# EAGLE board PROIECT (EAGLE 9.7.0)
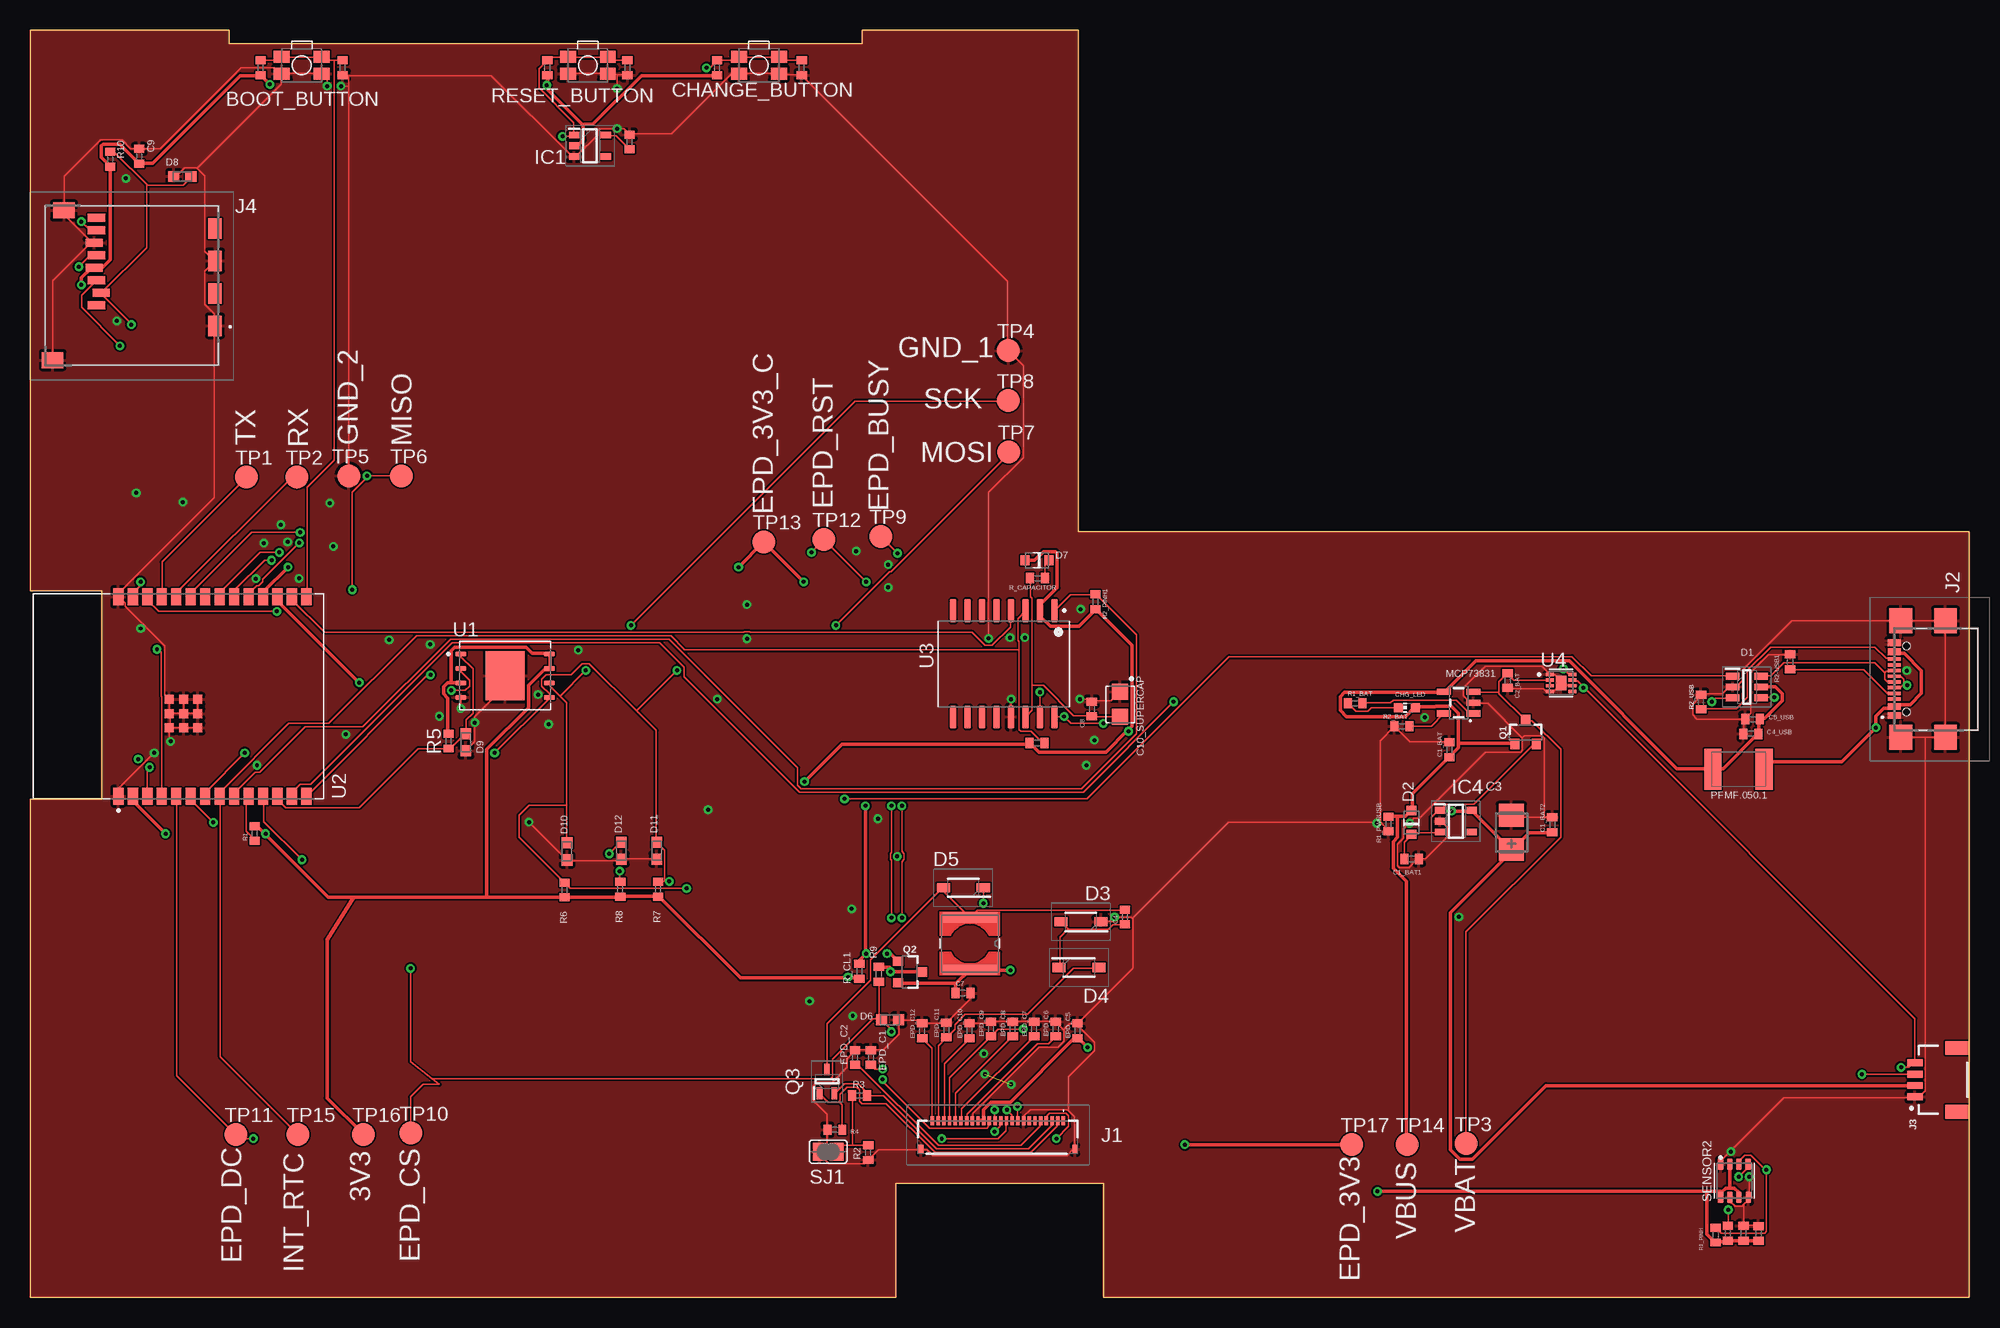
[diagram p1: board, top side]
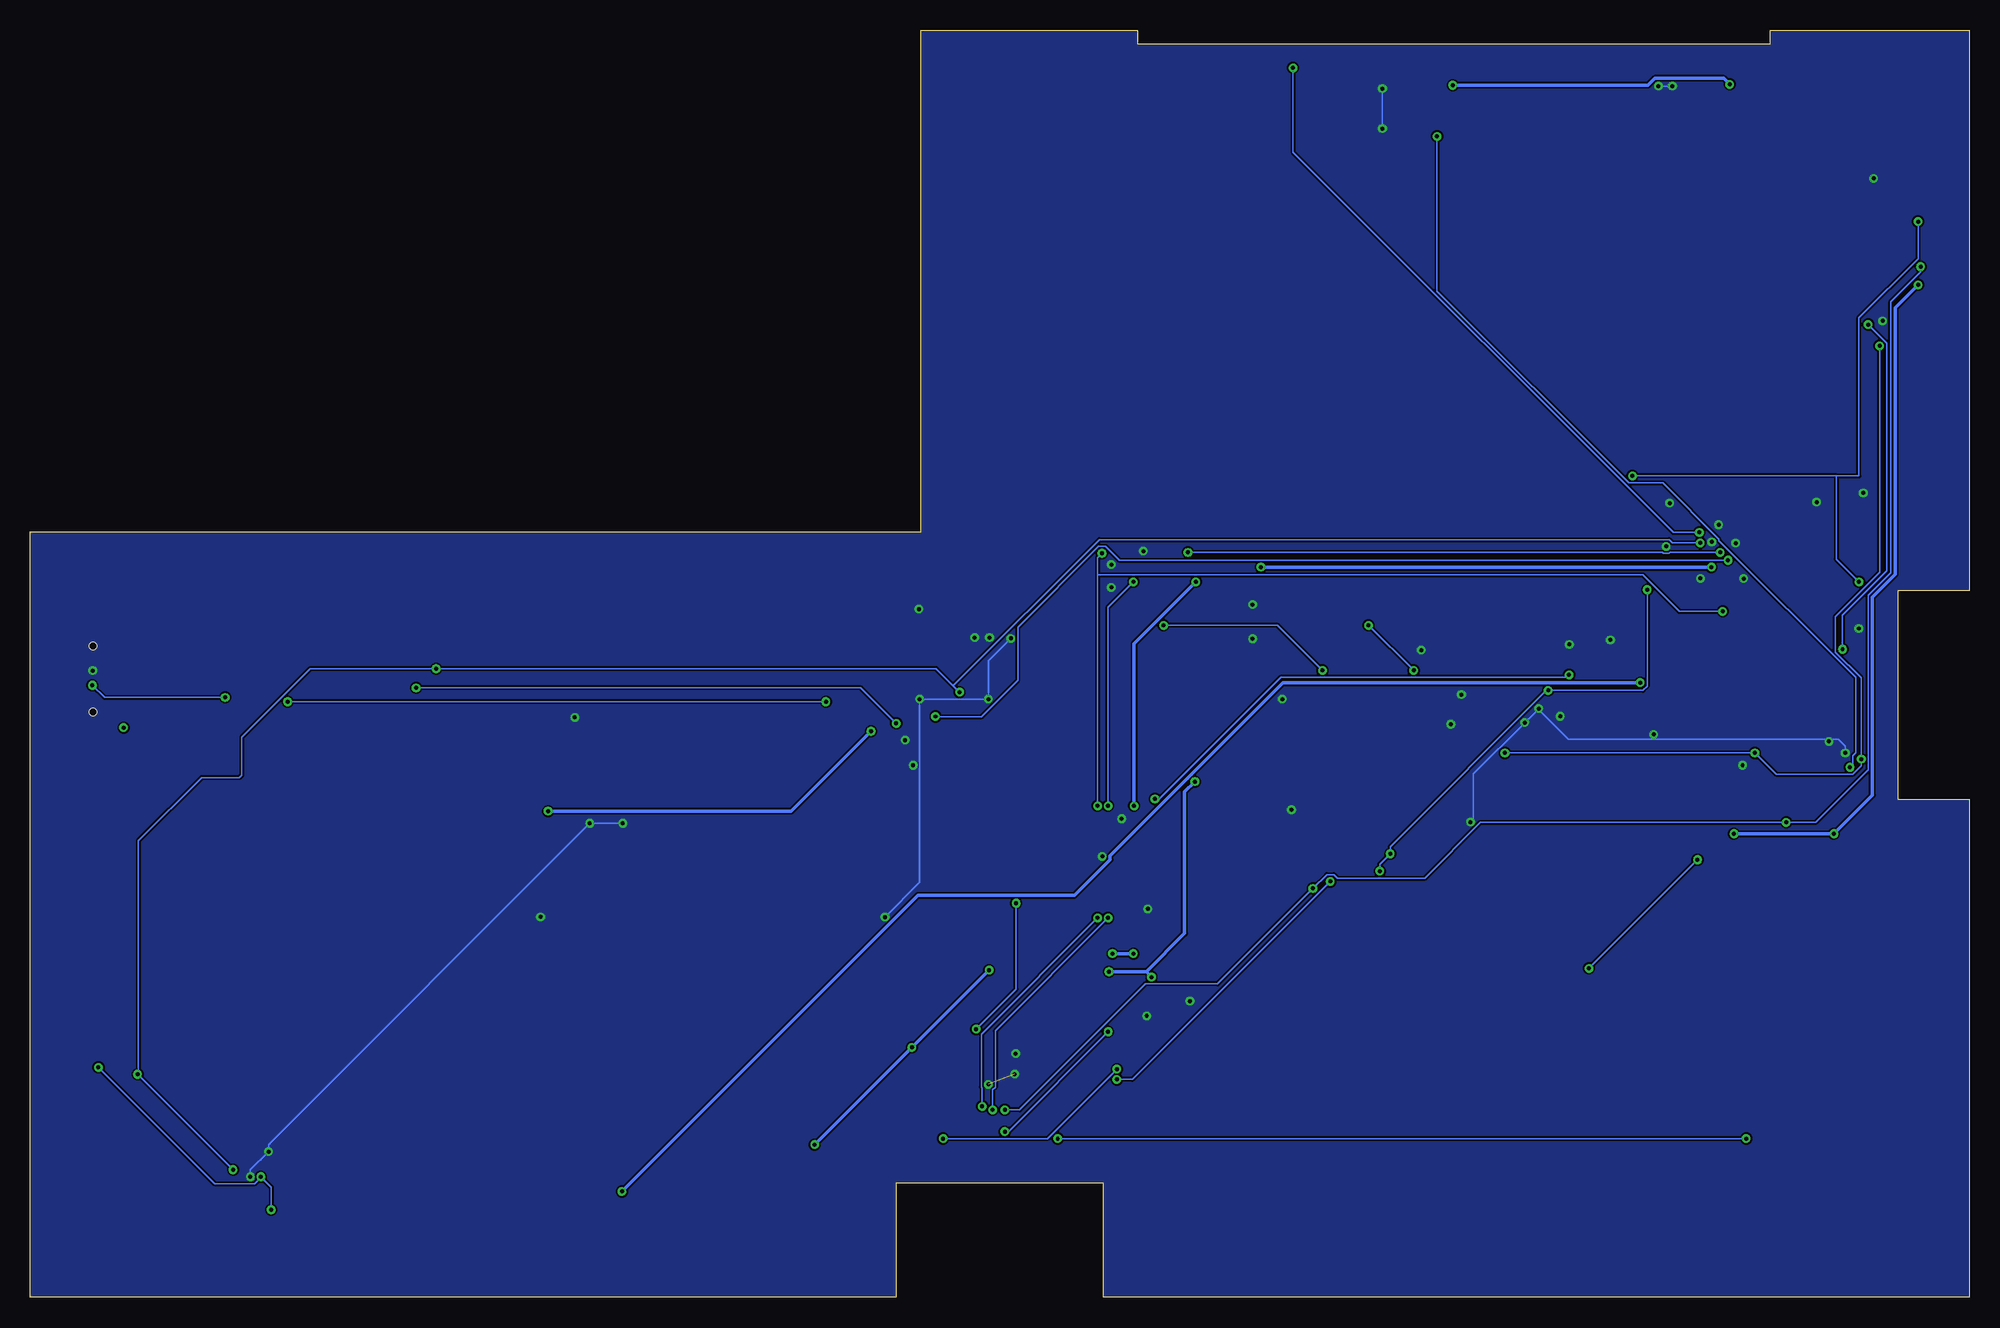
[diagram p2: board, bottom side, seen from below]

Size 170.2 x 111.2 mm. Coordinates in mm from the lower left corner, seen from the top.
Outline: 0,43.71 0,0 76,0 76,10 94.2,10 94.2,0 170.2,0 170.2,67.2 92,67.2 92,111.2 73,111.2 73,110 17.45,110 17.45,111.2 0,111.2 0,62 6.29,62 6.29,43.71 0,43.71
Copper layers (1*16): Top 0.035mm / dielectric 1.5mm / Bottom 0.035mm
Design rules "jlcpcb-2layers.dru": minimum track width 6mil, minimum drill 0.35mm, track to track 6mil, track to pad 6mil, pad to pad 6mil, via to via 6mil, smd to smd 6mil, copper to edge 0mil, drill to drill 6mil, minimum pad ring 10mil, minimum via ring 8mil, stop-mask expansion 4mil, vias tented up to drill 0mil, thermal gap 10mil
Net classes: 1 new_netclass: width 0.3 mm

## Footprints (pad centres in the part's own frame; a part is rotated, then mirrored left to right if it is on the bottom)
MYBUTTON = smd 1.4 x 1.05: 1 1.75,0.75; 2 -1.75,0.75; 3 -1.75,-0.75; 4 1.75,-0.75
ESP32_WROVER_EAGLE-LTSPICE_C0402 = smd 0.7 x 0.9: 1 -0.65,0; 2 0.65,0
EAGLE-LTSPICE_C0402 = smd 0.7 x 0.9: 1 -0.65,0; 2 0.65,0
RCL_CT3528 = smd 2 x 2.2: + -1.5,0; - 1.5,0
CAPCP3225X100N = smd 1.4 x 1.4: 1 -1.1,0; 2 1.1,0
ADAFRUIT_CHIP-LED0603 = smd 0.8 x 0.8: A 0,-0.75; C 0,0.75
SOT95P280X145-6N = smd 1.2 x 0.6: 1 -1.25,0.95; 2 -1.25,0; 3 -1.25,-0.95; 4 1.25,-0.95; 5 1.25,0; 6 1.25,0.95
ESP32_WROVER_AVX---SD0805S020S1R0_AVX_SD0805S020S1R0_0 = smd 0.8 x 0.9: 1 -1.05,0; 2 1.05,0
SOD3716X135N = smd 1.15 x 0.8: 1 -1.75,0; 2 1.75,0
DIOC1608X36N = smd 0.97 x 0.94: 1 -0.75,0; 2 0.75,0
SOT95P280X125-5N = smd 0.9 x 0.6: 1 -1.4,0.95; 2 -1.4,0; 3 -1.4,-0.95; 4 1.4,-0.95; 5 1.4,0.95
SOT95P280X120-5N = smd 0.9 x 0.6: 1 -1.4,0.95; 2 -1.4,0; 3 -1.4,-0.95; 4 1.4,-0.95; 5 1.4,0.95
FH34SRJ24S05SH99 = smd 0.3 x 0.8: 1 5.75,1.45; 2 5.25,1.45; 3 4.75,1.45; 4 4.25,1.45; 5 3.75,1.45; 6 3.25,1.45; 7 2.75,1.45; 8 2.25,1.45; 9 1.75,1.45; 10 1.25,1.45; 11 0.75,1.45; 12 0.25,1.45; 13 -0.25,1.45; 14 -0.75,1.45; 15 -1.25,1.45; 16 -1.75,1.45; 17 -2.25,1.45; 18 -2.75,1.45; 19 -3.25,1.45; 20 -3.75,1.45; 21 -4.25,1.45; 22 -4.75,1.45; 23 -5.25,1.45; 24 -5.75,1.45 | smd 0.4 x 0.8: MP1 6.75,-1.05; MP2 -6.75,-1.05
SAMACSYS_PARTS_USB4110GFA = smd 0.3 x 1.15: A1 -3.35,3.678; A4 -2.55,3.678; A5 -1.25,3.678; A6 -0.25,3.678; A7 0.25,3.678; A8 1.25,3.678; A9 2.55,3.678; A12 3.35,3.678; B1 3.05,3.678; B4 2.25,3.678; B5 1.75,3.678; B6 0.75,3.678; B7 -0.75,3.678; B8 -1.75,3.678; B9 -2.25,3.678; B12 -3.05,3.678 | smd 2.18 x 2: MP1 -5.11,-0.827; MP2 5.11,-0.827; MP3 -5.11,3.103; MP4 5.11,3.103 | hole 0.65: -2.89,2.603; 2.89,2.603
JST04_1MM_RA = smd 0.6 x 1.35: 1 -1.5,0; 2 -0.5,0; 3 0.5,0; 4 1.5,0 | smd 1.2 x 2: NC1 2.8,-3.675; NC2 -2.8,-3.675
112ATAARR03ATTEND = smd 1.8 x 1.2: G1 10.6,10.4; G2 4.9,10.4; S1 7.75,10.4; S2 2.05,10.4 | smd 1.4 x 1.9: G3 13.6,-3.85; G4 0.45,-2.85 | smd 0.7 x 1.5: P1 8.8,0; P2 7.7,0.4; P3 6.6,0; P4 5.5,-0.2; P5 4.4,0; P6 3.3,-0.2; P7 2.2,0; P8 1.1,0
IND_4828-WE-TPC_WRE = smd 0.889 x 4.826: 1 -2.286,0; 2 2.286,0
ESP32_WROVER_SPARKFUN-IC-POWER_SOT23-5 = smd 0.55 x 1.2: 1 -0.95,-1.3; 2 0,-1.3; 3 0.95,-1.3; 4 0.95,1.3; 5 -0.95,1.3
ESP32C6_VARISTOR_CT/CN1812 = smd 1.5 x 3.6: 1 -2.25,0; 2 2.25,0
ESP32_WROVER_SPARKFUN-DISCRETESEMI_SOT23-3 = smd 0.8 x 0.9: 1 -0.95,-1; 2 0.95,-1; 3 0,1.1
SOT65P210X110-3N = smd 1.05 x 0.5: 1 -1.05,0.65; 2 -1.05,-0.65; 3 1.05,0
ESP32_WROVER_EAGLE-LTSPICE_R0402 = smd 0.7 x 0.9: 1 -0.65,0; 2 0.65,0
ESP32_WROVER_BME680_PSON80P300X300X100-8N = smd 1.016 x 0.5: 1 1.458,1.2; 2 1.458,0.4; 3 1.458,-0.4; 4 1.458,-1.2; 5 -1.458,-1.22; 6 -1.458,-0.4; 7 -1.458,0.4; 8 -1.458,1.2
SJ = smd 1.168 x 1.6: 1 -0.762,0; 2 0.762,0
TP20R = smd 2 x 2: TP 0,0
SON127P600X800X80-9N = smd 0.94 x 0.44: 1 -3.895,1.905; 2 -3.895,0.635; 3 -3.895,-0.635; 4 -3.895,-1.905; 5 3.895,-1.905; 6 3.895,-0.635; 7 3.895,0.635; 8 3.895,1.905 | smd 3.4 x 4.3: 9 0,0
XCVR_ESP32-C6-WROOM-1-N8 = smd 1.5 x 0.9: 1 -8.75,5.26; 2 -8.75,3.99; 3 -8.75,2.72; 4 -8.75,1.45; 5 -8.75,0.18; 6 -8.75,-1.09; 7 -8.75,-2.36; 8 -8.75,-3.63; 9 -8.75,-4.9; 10 -8.75,-6.17; 11 -8.75,-7.44; 12 -8.75,-8.71; 13 -8.75,-9.98; 14 -8.75,-11.25; 15 8.75,-11.25; 16 8.75,-9.98; 17 8.75,-8.71; 18 8.75,-7.44; 19 8.75,-6.17; 20 8.75,-4.9; 21 8.75,-3.63; 22 8.75,-2.36; 23 8.75,-1.09; 24 8.75,0.18; 25 8.75,1.45; 26 8.75,2.72; 27 8.75,3.99; 28 8.75,5.26 | smd 0.8 x 0.8: 29_1 -2.755,0.79; 29_2 -1.505,0.79; 29_3 -0.255,0.79; 29_4 -2.755,-0.46; 29_5 -1.505,-0.46; 29_6 -0.255,-0.46; 29_7 -2.755,-1.71; 29_8 -1.505,-1.71; 29_9 -0.255,-1.71
SOIC127P1032X265-16N = smd 2.05 x 0.59: 1 -4.655,4.445; 2 -4.655,3.175; 3 -4.655,1.905; 4 -4.655,0.635; 5 -4.655,-0.635; 6 -4.655,-1.905; 7 -4.655,-3.175; 8 -4.655,-4.445; 9 4.655,-4.445; 10 4.655,-3.175; 11 4.655,-1.905; 12 4.655,-0.635; 13 4.655,0.635; 14 4.655,1.905; 15 4.655,3.175; 16 4.655,4.445
SON50P200X200X80-9N = smd 0.76 x 0.27: 1 -0.985,0.75; 2 -0.985,0.25; 3 -0.985,-0.25; 4 -0.985,-0.75; 5 0.985,-0.75; 6 0.985,-0.25; 7 0.985,0.25; 8 0.985,0.75 | smd 0.9 x 1.3: 9 0,0

## Placement (x,y rotation side)
BOOT_BUTTON  [MYBUTTON]  23.83,108.13 180 top
C1  100nF  [ESP32_WROVER_EAGLE-LTSPICE_C0402]  151.7,5.61 90 top
C1_BAT  4.7uF  [EAGLE-LTSPICE_C0402]  124.56,48.05 90 top
C1_BAT1  4.7uF  [ESP32_WROVER_EAGLE-LTSPICE_C0402]  121.25,38.47 0 top
C1_BAT2  4.7uF  [ESP32_WROVER_EAGLE-LTSPICE_C0402]  133.59,41.47 90 top
C2  100nF  [ESP32_WROVER_EAGLE-LTSPICE_C0402]  150.38,5.63 90 top
C2_BAT  4.7uF  [EAGLE-LTSPICE_C0402]  129.68,54.13 270 top
C3  100uF TANT  [RCL_CT3528]  130.01,40.8 90 top
C4  4.7uF/25V  [EAGLE-LTSPICE_C0402]  96.09,33.39 90 top
C4_USB  100nF  [ESP32_WROVER_EAGLE-LTSPICE_C0402]  151.03,49.45 180 top
C5  100nF  [EAGLE-LTSPICE_C0402]  52.42,107.91 270 top
C5_USB  4.7uF  [ESP32_WROVER_EAGLE-LTSPICE_C0402]  151.18,50.75 180 top
C6  100nF  [EAGLE-LTSPICE_C0402]  27.43,107.91 270 top
C7  10uF  [EAGLE-LTSPICE_C0402]  81.87,26.71 0 top
C8  100nF  [EAGLE-LTSPICE_C0402]  93.18,51.63 90 top
C9  100nF  [EAGLE-LTSPICE_C0402]  9.56,100.13 90 top
C10  100nF  [EAGLE-LTSPICE_C0402]  67.72,107.91 270 top
C10_SUPERCAP  CPH3225A  [CAPCP3225X100N]  95.66,52.04 270 top
C_DELAY  100nF  [EAGLE-LTSPICE_C0402]  52.61,101.39 90 top
CHANGE_BUTTON  [MYBUTTON]  63.96,108.13 180 top
CHG_LED  [ADAFRUIT_CHIP-LED0603]  120.84,51.75 90 top
D1  USBLC6-2SC6Y  [SOT95P280X145-6N]  150.68,53.57 0 top
D2  ESP32_WROVER_AVX---SD0805S020S1R0_AVX_SD0805S020S1R0_0_0AVX_SD0805S020S1R0_0_0  [ESP32_WROVER_AVX---SD0805S020S1R0_AVX_SD0805S020S1R0_0]  121.23,41.68 90 top
D3  [SOD3716X135N]  92.22,32.95 180 top
D4  [SOD3716X135N]  92.06,28.95 0 top
D5  [SOD3716X135N]  81.9,35.95 180 top
D6  PGB1010603MR'''  [DIOC1608X36N]  75.48,24.37 180 top
D7  ESP32_WROVER_AVX---SD0805S020S1R0_AVX_SD0805S020S1R0_0_0AVX_SD0805S020S1R0_0_0  [ESP32_WROVER_AVX---SD0805S020S1R0_AVX_SD0805S020S1R0_0]  88.38,64.68 180 top
D8  PGB1010603MR'''  [DIOC1608X36N]  13.36,98.37 0 top
D9  PGB1010603MR'''  [DIOC1608X36N]  38.24,48.71 90 top
D10  PGB1010603MR'''  [DIOC1608X36N]  47.12,39.13 90 top
D11  PGB1010603MR'''  [DIOC1608X36N]  55,39.21 90 top
D12  PGB1010603MR'''  [DIOC1608X36N]  51.88,39.21 90 top
EPD_C1  1uF/50V  [EAGLE-LTSPICE_C0402]  73.79,21.05 90 top
EPD_C2  1uF/50V  [EAGLE-LTSPICE_C0402]  72.4,21.05 90 top
EPD_C5  0.1uF/50V  [EAGLE-LTSPICE_C0402]  91.93,23.39 90 top
EPD_C6  1uF/50V  [EAGLE-LTSPICE_C0402]  90.01,23.55 90 top
EPD_C7  1uF/50V  [EAGLE-LTSPICE_C0402]  88.12,23.55 90 top
EPD_C8  1uF/50V  [EAGLE-LTSPICE_C0402]  86.23,23.55 90 top
EPD_C9  1uF/50V  [EAGLE-LTSPICE_C0402]  84.34,23.55 90 top
EPD_C10  1uF/50V  [EAGLE-LTSPICE_C0402]  82.45,23.39 90 top
EPD_C11  1uF/50V  [EAGLE-LTSPICE_C0402]  80.41,23.47 90 top
EPD_C12  1uF/50V  [EAGLE-LTSPICE_C0402]  78.29,23.39 90 top
IC1  BD5229G-TR  [SOT95P280X125-5N]  49.13,101.06 0 top
IC4  XC6220A331MR-G  [SOT95P280X120-5N]  125.13,41.79 0 top
J1  FH34SRJ-24S-0.5SH_99_  [FH34SRJ24S05SH99]  84.94,14.04 0 top
J2  SAMACSYS_PARTS_USB4110-GF-A  [SAMACSYS_PARTS_USB4110GFA]  167.28,54.26 90 top
J3  QWIIC_RIGHT_ANGLE  [JST04_1MM_RA]  165.43,19.1 90 top
J4  112A-TAAR-R03_ATTEND  [112ATAARR03ATTEND]  5.82,95.85 270 top
L1  68uH  [IND_4828-WE-TPC_WRE]  82.47,31.05 270 top
MCP73831  ESP32_WROVER_SPARKFUN-IC-POWER_MCP73831  [ESP32_WROVER_SPARKFUN-IC-POWER_SOT23-5]  125.38,52.19 90 top
PFMF.050.1  ESP32C6_VARISTORCN1812  [ESP32C6_VARISTOR_CT/CN1812]  149.94,46.35 180 top
Q1  20V/4.2A/52mΩ/1.4W  [ESP32_WROVER_SPARKFUN-DISCRETESEMI_SOT23-3]  131.26,49.56 0 top
Q2  20V/4.2A/52mΩ/1.4W  [ESP32_WROVER_SPARKFUN-DISCRETESEMI_SOT23-3]  77.18,28.56 270 top
Q3  SI1308EDL-T1-GE3  [SOT65P210X110-3N]  69.93,18.95 90 top
R1  10K  [ESP32_WROVER_EAGLE-LTSPICE_R0402]  19.71,40.71 90 top
R1_BAT  200  [ESP32_WROVER_EAGLE-LTSPICE_R0402]  116.29,52.13 0 top
R1_PINH  10K  [ESP32_WROVER_EAGLE-LTSPICE_R0402]  147.93,5.47 270 top
R1_PINH1  10K  [ESP32_WROVER_EAGLE-LTSPICE_R0402]  88.37,48.65 180 top
R1_PWRUSB  100k  [ESP32_WROVER_EAGLE-LTSPICE_R0402]  119.22,41.54 90 top
R2  2.2  [ESP32_WROVER_EAGLE-LTSPICE_R0402]  73.55,12.71 90 top
R2-USB1  5K1  [ESP32_WROVER_EAGLE-LTSPICE_R0402]  154.47,55.77 270 top
R2_BAT  2K  [ESP32_WROVER_EAGLE-LTSPICE_R0402]  120.4,50.13 0 top
R2_PINH  10K  [ESP32_WROVER_EAGLE-LTSPICE_R0402]  149.01,5.63 270 top
R2_PINH1  10K  [ESP32_WROVER_EAGLE-LTSPICE_R0402]  93.5,61.05 270 top
R2_USB  5K1  [ESP32_WROVER_EAGLE-LTSPICE_R0402]  146.65,52.25 90 top
R3  0.47  [ESP32_WROVER_EAGLE-LTSPICE_R0402]  72.79,17.71 0 top
R4  10K  [ESP32_WROVER_EAGLE-LTSPICE_R0402]  70.63,14.71 0 top
R5  10K  [ESP32_WROVER_EAGLE-LTSPICE_R0402]  36.72,48.82 90 top
R6  10K  [ESP32_WROVER_EAGLE-LTSPICE_R0402]  46.91,35.75 270 top
R7  10K  [ESP32_WROVER_EAGLE-LTSPICE_R0402]  55.1,35.82 270 top
R8  10K  [ESP32_WROVER_EAGLE-LTSPICE_R0402]  51.79,35.82 270 top
R9  10K  [ESP32_WROVER_EAGLE-LTSPICE_R0402]  74.48,28.37 90 top
R10  10K  [ESP32_WROVER_EAGLE-LTSPICE_R0402]  7.03,99.87 270 top
R_BOOT  10K  [ESP32_WROVER_EAGLE-LTSPICE_R0402]  20.22,107.91 270 top
R_CAPACITOR  15  [ESP32_WROVER_EAGLE-LTSPICE_R0402]  88.42,63.12 180 top
R_CHANGE  10K  [ESP32_WROVER_EAGLE-LTSPICE_R0402]  60.29,107.91 270 top
R_CL1  10K  [ESP32_WROVER_EAGLE-LTSPICE_R0402]  72.78,28.63 270 top
R_RESET  10K  [ESP32_WROVER_EAGLE-LTSPICE_R0402]  45.39,107.91 270 top
RESET_BUTTON  [MYBUTTON]  48.95,108.13 180 top
SENSOR2  ESP32_WROVER_BME680_BME680  [ESP32_WROVER_BME680_PSON80P300X300X100-8N]  149.58,10.24 90 top
SJ1  [SJ]  70.04,12.79 0 top
TP1  [TP20R]  18.99,71.99 0 top
TP2  [TP20R]  23.41,71.99 0 top
TP3  [TP20R]  126.03,13.49 0 top
TP4  [TP20R]  85.85,83.09 0 top
TP5  [TP20R]  27.97,72.09 0 top
TP6  [TP20R]  32.59,72.09 0 top
TP7  [TP20R]  85.91,74.19 0 top
TP8  [TP20R]  85.83,78.69 0 top
TP9  [TP20R]  74.65,66.79 0 top
TP10  [TP20R]  33.4,14.41 0 top
TP11  [TP20R]  18.05,14.31 0 top
TP12  [TP20R]  69.65,66.52 0 top
TP13  [TP20R]  64.4,66.31 0 top
TP14  [TP20R]  120.85,13.41 0 top
TP15  [TP20R]  23.5,14.31 0 top
TP16  [TP20R]  29.25,14.31 0 top
TP17  [TP20R]  116,13.41 0 top
U1  W25Q512JVEIQ  [SON127P600X800X80-9N]  41.69,54.56 0 top
U2  ESP32-C6-WROOM-1-N8  [XCVR_ESP32-C6-WROOM-1-N8]  13,52.74 90 top
U3  DS3231SN#  [SOIC127P1032X265-16N]  85.45,55.6 270 top
U4  MAX17048G+T10  [SON50P200X200X80-9N]  134.37,53.92 0 top

## Tracks (layer width: path | path; a pad name or v marks a point on that pad's centre or on a via)
3V3  (via drill 0.35)
  Top 0.3: 45.41,106.38 45.41,105.99 48.54,102.87 | 45.41,106.38 45.41,107.21 R_RESET.2 | 48.54,102.87 48.54,101.58 48.08,101.12 47.78,101.12 IC1.2 | R_CHANGE.2 60.27,107.21 53.65,107.21 49.38,102.95 48.62,102.95 48.54,102.87 | v21.03,106.45 20.27,107.21 R_BOOT.2 20.19,107.21 18.44,107.21 10.74,99.52 9.68,99.52 C9.1 9.53,99.52 7.85,101.19 6.4,101.19 6.25,101.04 6.25,100.05 7.01,99.29 R10.2 7.01,99.06 7.01,91.06 6.33,90.37 5.64,90.37 J4.P4 5.49,90.3 5.33,90.3 4.5,89.46 v4.5,88.85 | v45.34,106.38 45.41,106.38 | C3.+ 130,39.24 126.57,42.67 IC4.5 126.42,42.67 v124.74,42.67 | C1_BAT2.1 133.58,40.77 131.6,40.77 130.15,39.32 C3.+ | J3.2 133.04,18.59 126.57,12.12 125.5,12.12 124.66,12.95 124.66,33.76 130,39.09 C3.+ | D7.2 87.4,64.69 88.16,64.69 88.92,65.46 89.99,65.46 90.14,65.3 90.14,62.26 88.7,60.81 88.7,60.27 U3.2 88.7,60.12 88.7,59.74 89.53,58.9 92.05,58.9 93.42,60.27 R2_PINH1.2 93.57,60.35 96.7,57.23 96.7,50.14 96.32,49.76 | 96.32,49.76 94.41,47.85 88.54,47.85 87.78,48.62 R1_PINH1.2 87.63,48.54 71.25,48.54 v67.97,45.26 | 36.96,53.95 37.72,53.95 U1.3 | 36.96,53.95 36.65,53.95 36.27,53.57 36.27,52.96 36.65,52.58 36.65,49.53 R5.2 | 36.96,53.95 36.96,56.77 37.26,57.07 43.51,57.07 44.04,56.54 45.49,56.54 U1.8 45.64,56.46 45.64,55.24 U1.7 45.49,55.09 45.11,55.09 43.74,53.72 43.74,51.74 40.08,48.08 40.08,35.13 | 75.67,28.73 75.82,28.57 78.26,28.57 Q2.3 | 75.67,28.73 75.44,28.96 74.52,28.96 R9.2 | 71.78,28.04 62.33,28.04 55.24,35.13 R7.2 55.09,35.2 51.89,35.2 R8.2 51.74,35.13 46.94,35.13 R6.2 46.79,35.13 40.08,35.13 | 71.78,28.04 72.77,28.04 R_CL1.2
  Top 0.3: 20.61,40.65 26.14,35.13 28.4,35.13 | 20.61,40.65 19.96,41.3 19.74,41.3 R1.2 | 40.08,35.13 28.4,35.13 | v11.89,40.69 9.07,43.51 9.07,43.97 U2.2 | v20.65,40.69 20.61,40.65 | TP16.TP 26.06,17.5 26.06,31.4 28.4,35.13 | v75.51,28.57 75.67,28.73 | v71.78,28.12 71.78,28.04 | v96.39,49.68 96.32,49.76
  Bottom 0.3: v45.34,106.38 28.19,106.38 27.58,106.98 21.57,106.98 v21.03,106.45 | v20.65,40.69 v11.89,40.69 8.5,44.08 8.5,61.44 6.5,63.44 6.5,86.85 v4.5,88.85 | 72.24,28.57 v75.51,28.57 | v71.78,28.12 72.24,28.57 | v67.97,45.26 68.87,44.36 68.87,31.94 72.24,28.57 | v124.74,42.67 103.4,42.67 v96.39,49.68
32KHZ
  Top 0.152: U3.1 89.92,60.27 91.29,61.65 93.5,61.65 R2_PINH1.1 93.57,61.65 97.08,58.14 97.08,49.45 92.28,44.65 67.67,44.65 67.36,44.96 67.36,46.48 56.08,57.76 36.88,57.76 29.18,50.06 24.12,50.06 20.15,46.09 19.75,46.09 17.91,44.25 17.91,44.04 U2.9
DN  (via drill 0.35)
  Top 0.152: 164.4,53.76 164.44,53.8 164.44,54.25 164.21,54.48 163.68,54.48 J2.A7 | 164.4,53.76 164.21,53.57 163.68,53.57 J2.B7 | v153.09,52.65 151.94,52.65 D1.4 | v164.74,53.72 164.44,53.72 164.4,53.76
  Bottom 0.152: v153.09,52.65 163.68,52.65 v164.74,53.72
DP
  Top 0.152: 162.8,54.83 162.92,54.94 163.6,54.94 J2.B6 | 162.8,54.83 162.76,54.79 162.76,54.25 162.99,54.03 163.6,54.03 J2.A6 | 162.8,54.83 161.93,55.7 153.92,55.7 152.78,54.56 151.94,54.56 D1.6
EPD_3V3  (via drill 0.35)
  Top 0.3: 81.23,27.51 81.23,26.75 C7.1 | 81.23,27.51 82.45,28.73 L1.2 82.6,28.73 v86.03,28.73 | Q2.2 76.2,27.58 81.15,27.58 81.23,27.51 | J1.16 83.21,15.54 83.67,15.54 J1.15 83.67,15.7 83.67,16.46 84.35,17.14 86.03,17.14 91.59,22.71 91.9,22.71 EPD_C5.1 92.05,22.71 v92.81,21.95 | v101.35,13.41 115.98,13.41 TP17.TP
  Bottom 0.3: v101.35,13.41 v92.81,21.95 v86.03,28.73
EPD_3V3_C  (via drill 0.35)
  Top 0.3: v75.21,30.18 75.51,30.18 76.12,29.57 Q2.1 | R_CL1.1 72.85,29.34 72.85,29.64 v73.38,30.18 73.3,30.25 v73.3,43.13 | v22.63,64.08 20.5,61.95 20.5,61.49 U2.18 | v62.18,64.08 64.39,66.29 TP13.TP 64.47,66.22 v67.89,62.79
  Bottom 0.3: v75.21,30.18 v73.38,30.18 | v62.18,64.08 v22.63,64.08 | v73.3,43.13 73.3,57.38 v67.89,62.79
EPD_BUSY  (via drill 0.35)
  Top 0.152: v86.64,16.76 86.64,15.54 J1.9 | v76.12,65.3 74.68,66.75 TP9.TP | v21.64,60.2 11.28,60.2 10.29,61.19 10.29,61.42 U2.26 | v76.5,43.13 76.5,39.15 76.71,38.95 76.71,38.45 76.5,38.25 v76.5,33.3
  Bottom 0.152: 76.5,63.4 76.5,64.92 v76.12,65.3 | 76.5,63.4 v76.5,43.13 | v21.64,60.2 25.45,60.2 28.65,63.4 76.5,63.4 | v86.64,16.76 86.64,18.38 86.71,18.45 86.71,23.1 v76.5,33.3
EPD_CS  (via drill 0.35)
  Top 0.152: v84.66,14.55 85.11,15.01 85.11,15.47 J1.12 | v75.59,23.32 75.59,23.47 74.75,24.31 D6.2 | R9.1 74.52,27.66 74.52,24.54 74.68,24.38 D6.2 | v23.85,38.41 20.5,41.76 20.5,43.97 U2.11 | v33.38,28.88 33.38,20.7 35.3,19.2 | TP10.TP 33.38,14.48 33.38,17.6 34.48,18.7 35.9,18.7 35.26,19.2 35.3,19.2 | 35.3,19.2 70.26,19.2 70.41,19.36 70.41,20.88 73.99,24.46 74.52,24.46 D6.2
  Bottom 0.152: v84.66,14.55 84.35,14.55 v75.59,23.32 | v33.38,28.88 v23.85,38.41
EPD_DC  (via drill 0.35)
  Top 0.152: v80.01,13.95 84.96,13.95 85.65,14.63 85.65,15.47 J1.11 | v19.58,13.95 18.36,13.95 18.06,14.25 TP11.TP 17.98,14.33 12.88,19.43 12.88,43.97 U2.5
  Bottom 0.152: v19.58,13.95 v80.01,13.95
EPD_RST  (via drill 0.35)
  Top 0.152: v85.72,16.46 86.18,16 86.18,15.54 J1.10 | v73.38,62.79 69.72,66.45 TP12.TP 69.65,66.45 v68.58,65.38 | v21.87,65.38 20.19,65.38 16.69,61.87 16.69,61.49 U2.21 | v75.59,43.13 75.59,39.05 75.49,38.95 75.49,38.45 75.59,38.35 v75.59,33.3
  Bottom 0.152: v75.59,43.13 75.59,60.58 v73.38,62.79 | v85.72,16.46 85.72,18.22 85.49,18.45 85.49,23.4 v75.59,33.3 | v68.58,65.38 26.94,65.38 26.85,65.29 26.35,65.29 26.26,65.38 v21.87,65.38
FLASH_CS
  Top 0.152: U1.1 37.8,56.24 38.86,55.17 38.86,51.28 38.25,50.67 38.25,49.53 D9.2 38.18,49.45 36.96,48.23 36.73,48.23 R5.1 36.65,48.16 34.06,48.16 28.88,42.98 22.4,42.98 21.72,43.66 21.72,43.97 U2.12
GDR
  Top 0.152: 70.98,17.18 70.94,17.14 70.03,17.14 69.34,17.83 Q3.1 | 70.98,17.18 71.09,17.3 71.09,17.83 71.7,18.44 72.54,18.44 72.77,18.21 72.77,17.22 73,16.99 75.13,16.99 79.4,12.72 87.86,12.72 90.14,15.01 90.14,15.47 J1.2 | 70.98,17.18 71.25,16.92 71.25,14.78 R4.2
GND  (via drill 0.35)  (1 unrouted)
  Top 0.152: C1.2 151.64,6.33 150.42,6.33 C2.2 150.42,6.4 150.42,8.08 150.38,8.12 | 150.38,8.12 150.8,8.53 150.8,8.76 SENSOR2.5 150.88,8.84 v150.88,10.59 | 150.38,8.12 150.27,8 149.66,8 149.2,8.46 149.2,8.76 SENSOR2.7 | 149.24,12.84 153.92,17.53 165.43,17.53 J3.1 165.51,17.6 165.81,17.6 166.34,18.14 166.34,49.15 | 149.24,12.84 148.44,12.04 148.44,11.73 SENSOR2.1 | v149.28,12.8 149.24,12.84 | C4_USB.2 150.42,49.45 150.42,50.67 150.5,50.75 C5_USB.2 | R2-USB1.1 154.46,56.39 152.55,56.39 151.03,54.86 151.03,51.28 150.57,50.83 C5_USB.2 | C5_USB.2 150.42,50.75 146.3,50.75 145.92,51.13 145.92,52.05 146.61,52.73 146.61,52.88 R2_USB.2 146.69,52.96 148.51,52.96 149.12,53.57 D1.2 149.5,53.65 149.81,53.65 150.42,54.25 150.42,55.17 154.61,59.36 164,59.36 | 166.34,49.15 168.1,49.15 J2.MP1 168.1,49.23 168.1,59.28 J2.MP2 168.1,59.36 164.21,59.36 J2.MP4 164.13,59.36 164,59.36 | 166.34,49.15 164.21,49.15 J2.MP3 163.6,49.73 J2.A1 J2.B12 | 132.89,42.14 130.15,42.14 130,42.29 C3.- | 132.89,42.14 133.58,42.14 C1_BAT2.2 | IC4.2 123.75,41.76 123.9,41.76 124.44,41.22 124.44,40.46 122.45,38.48 121.92,38.48 C1_BAT1.2 121.84,38.41 121.69,38.41 121.01,37.72 120.17,37.72 120.02,37.87 120.02,39.78 120.55,40.31 120.55,41.15 121.04,41.64 | U4.9 134.42,53.87 133.73,53.19 133.43,53.19 U4.4 133.35,53.19 133.04,53.19 132.82,53.42 129.69,53.42 C2_BAT.2 | U4.9 134.34,53.95 134.34,54.1 133.81,54.63 133.43,54.63 U4.1 133.35,54.71 132.66,55.4 127.71,55.4 125.81,53.49 125.81,52.81 126.42,52.2 126.64,52.2 MCP73831.2 126.72,52.12 127.94,52.12 130.95,49.11 | U4.6 135.33,53.72 134.34,53.72 U4.9
  Top 0.152: 121.04,41.64 121.46,42.06 121.92,42.06 127.71,47.85 130.84,47.85 130.99,48.01 130.99,49.07 130.95,49.11 | 132.89,42.14 132.89,49.07 132.66,49.3 131.14,49.3 130.95,49.11 | C7.2 82.45,26.67 82.45,26.14 80.47,24.16 EPD_C11.2 80.39,24.08 78.33,24.08 EPD_C12.2 78.26,24.08 78.03,24.31 76.28,24.31 D6.1 76.28,24.23 76.28,23.09 74.91,21.72 73.84,21.72 EPD_C1.2 73.76,21.72 72.47,21.72 EPD_C2.2 72.39,21.64 71.7,20.95 71.7,20.19 70.41,18.9 69.11,18.9 68.73,18.52 68.73,17.3 69.95,16.08 69.95,14.78 R4.1 69.95,14.71 69.95,13.41 69.34,12.8 SJ1.1 69.34,12.72 69.34,12.5 70.1,11.73 73.23,11.73 73.53,12.04 R2.1 73.61,12.12 74.45,12.95 78.18,12.95 J1.MP2 78.26,12.95 78.72,12.95 79.25,12.42 90.98,12.42 91.59,13.03 J1.MP1 91.67,13.03 91.67,15.85 91.1,16.42 | 118.53,41.72 118.49,41.76 118.49,48.84 119.71,50.06 R2_BAT.1 119.79,50.06 121.08,48.77 124.51,48.77 C1_BAT.2 | 118.53,41.72 119.18,41.07 119.18,40.92 R1_PWRUSB.1 | C10_SUPERCAP.1 95.63,53.11 94.87,52.35 93.19,52.35 C8.2 93.12,52.35 92.96,52.5 v92.13,52.5 | v86.11,52.5 86.11,50.98 U3.13 | 91.1,16.42 91.06,16.46 87.78,16.46 87.25,15.93 87.25,15.54 J1.8 | EPD_C10.2 82.53,24.08 84.2,24.08 84.28,24.16 EPD_C9.2 84.35,24.23 86.18,24.23 EPD_C8.2 86.26,24.23 88.09,24.23 EPD_C7.2 88.16,24.23 89.99,24.23 EPD_C6.2 90.07,24.16 90.72,23.51 | 90.72,23.51 90.75,23.47 90.75,22.48 90.22,21.95 88.54,21.95 82.75,16.15 82.75,15.54 J1.17 | 90.72,23.51 91.21,24 91.9,24 EPD_C5.2 | 95.36,33.19 95.56,33.38 96.62,33.38 96.74,33.26 | 95.36,33.19 95.17,32.99 94.03,32.99 D3.1 | 96.74,33.26 96.77,33.22 96.77,28.88 91.97,24.08 EPD_C5.2
  Top 0.152: 91.1,16.42 91.14,16.46 91.14,19.36 93.42,21.64 93.42,22.4 91.9,23.93 EPD_C5.2 | 95.36,33.19 v95.17,33.38 | 118.19,41.68 105.16,41.68 96.74,33.26 | 118.19,41.68 118.49,41.68 118.53,41.72 | 118.19,41.68 v118.19,41.6 | v121.08,41.6 121.04,41.64 | 51.51,107.29 50.83,107.29 50.75,107.37 RESET_BUTTON.2 50.67,107.44 47.24,107.44 RESET_BUTTON.1 | 51.51,107.29 52.35,107.29 C5.2 | 27.96,107.21 40.46,107.21 47.55,100.13 47.7,100.13 IC1.3 47.78,100.13 47.93,100.13 49.84,102.03 49.84,102.41 49.99,102.56 v51.51,102.56 52.12,102.56 52.58,102.11 C_DELAY.2 52.65,102.11 56.31,102.11 61.57,107.37 62.18,107.37 CHANGE_BUTTON.1 62.26,107.44 65.68,107.44 CHANGE_BUTTON.2 65.76,107.37 65.84,107.29 67.67,107.29 C10.2 67.74,107.21 85.8,89.15 85.8,83.13 TP4.TP 85.88,83.06 87.17,81.76 87.17,73.69 84.12,70.64 v84.12,57.84 | 27.96,107.21 27.51,107.21 C6.2 | 27.96,107.21 27.96,106.3 | 27.96,106.3 27.96,72.16 TP5.TP | v51.51,106.07 51.51,107.29 | J4.G3 1.98,82.3 1.98,89.23 5.33,92.58 J4.P6 5.56,92.58 5.41,92.58 2.97,95.02 2.97,95.33 J4.G4 2.97,98.37 6.17,101.58 8.08,101.58 8.84,100.81 9.53,100.81 C9.2 9.6,100.81 11.43,100.81 18.52,107.9 21.41,107.9 21.95,107.37 BOOT_BUTTON.1 | BOOT_BUTTON.1 22.1,107.44 25.53,107.44 BOOT_BUTTON.2 25.6,107.37 26.06,106.91 v26.06,106.3 | 14.67,99.1 15.32,98.45 15.32,91.82 16.15,90.98 J4.G2 16.15,90.91 15.32,90.07 15.32,87.17 16.15,86.33 16.15,85.27 J4.G1 16.15,85.19 16.15,70.18 7.77,61.8 7.77,61.49 U2.28 8.33,60.9 8.33,60.65 11.81,57.17 11.81,52.88 U2.29_3 12.19,52.43 12.19,51.28 U2.29_2 | 14.67,99.1 14.63,99.14 13.56,99.14 12.8,98.37 12.65,98.37 D8.1
  Top 0.152: 14.67,99.1 22.02,106.45 22.02,107.37 BOOT_BUTTON.1 | U2.29_1 12.27,49.99 13.41,49.99 U2.29_4 13.49,49.99 U2.29_7 | U2.1 7.77,44.04 7.77,44.68 v10.88,47.79 | U2.29_5 13.49,51.28 13.49,52.43 U2.29_6 | U2.29_5 13.56,51.28 14.71,51.28 U2.29_8 14.71,51.36 14.71,52.43 U2.29_9 | U2.29_2 12.27,51.28 13.41,51.28 U2.29_5 | U2.29_1 12.27,50.06 12.27,51.21 U2.29_2 | D11.1 54.94,38.48 51.89,38.48 D12.1 51.82,38.41 51.74,38.33 47.17,38.33 D10.1 v43.78,41.71 | v37.8,51.66 U1.4 | D9.1 38.25,48.01 39.01,48.77 v39.01,50.44 39.01,50.98 41.68,53.65 U1.9 | v27.28,106.3 27.96,106.3 | 164,59.36 163.6,58.96 J2.A12 J2.B1 | v12.32,48.79 12.21,48.9 U2.29_1 | 76,0 0,0 0,43.71 6.29,43.71 6.29,62 0,62 0,111.2 17.45,111.2 17.45,110 73,110 73,111.2 92,111.2 92,67.2 170.2,67.2 170.2,0 94.2,0 94.2,10 76,10 76,0
  Bottom 0.152: v150.88,10.59 150.88,11.2 v149.28,12.8 149.28,13.41 v121.08,41.6 v118.19,41.6 | v95.17,33.38 92.13,36.42 v92.13,52.5 v86.11,52.5 86.11,55.85 v84.12,57.84 | v51.51,102.56 v51.51,106.07 | 12.11,49 35.2,49 37.8,51.59 v37.8,51.66 v39.01,50.44 43.51,45.95 43.51,41.99 v43.78,41.71 | v26.06,106.3 v27.28,106.3 | 12.11,49 11.51,49 10.88,48.38 v10.88,47.79 | 12.11,49 v12.32,48.79
  other vias: 59.5,42.8 62.9,60.8 13.4,69.8 9.7,58.7 9.3,70.6 26.3,69.7 72.1,34.1 68.4,26 125.4,33.4 164.71,55 22,67.8 20.5,66.2 23.6,63.1 31.5,57.7 35.1,57.3 48.1,56.8 62.9,57.8 60.3,52.5 93.4,48.9 92.7,46.7 74.4,42 45.5,50.3 35.9,51 27.7,49.4 92.2,60.4 87.3,57.9 86,57.9 83.7,21.4 83.8,19.6 72.2,24.7 76.1,38.7 19.9,46.7 44.58,52.9 122.4,50.9 19.8,63.08 8.4,98.2 7.6,85.7 86.1,18.7 75.3,62.3 75.3,64.3 72.5,65.5 26.6,65.9 22.6,66.3
  pour Top: 6.35,43.67 6.33,43.65 6.3,43.63 0.08,43.63 0.08,0.08 75.92,0.08 75.92,10.02 75.94,10.04 75.96,10.06 75.98,10.08 94.22,10.08 94.24,10.06 94.26,10.04 94.28,10.02 94.28,0.08 170.12,0.08 170.12,67.12 91.98,67.12 91.96,67.14 91.94,67.16 91.92,67.18 91.92,111.12 73.08,111.12 73.08,109.98 73.06,109.96 73.04,109.94 73.02,109.92 17.43,109.92 17.4,109.94 17.38,109.96 17.37,109.98 17.37,111.12 0.08,111.12 0.08,62.08 6.3,62.08 6.33,62.06 6.35,62.04 6.37,62.02 6.37,43.7
  pour Bottom: 6.35,43.67 6.33,43.65 6.3,43.63 0.08,43.63 0.08,0.08 75.92,0.08 75.92,10.02 75.94,10.04 75.96,10.06 75.98,10.08 94.22,10.08 94.24,10.06 94.26,10.04 94.28,10.02 94.28,0.08 170.12,0.08 170.12,67.12 91.98,67.12 91.96,67.14 91.94,67.16 91.92,67.18 91.92,111.12 73.08,111.12 73.08,109.98 73.06,109.96 73.04,109.94 73.02,109.92 17.43,109.92 17.4,109.94 17.38,109.96 17.37,109.98 17.37,111.12 0.08,111.12 0.08,62.08 6.3,62.08 6.33,62.06 6.35,62.04 6.37,62.02 6.37,43.7
GPIO8
  Top 0.152: R1.1 19.66,40.08 19.66,40.23 18.97,40.92 18.97,43.81 19.13,43.97 U2.10
I2C_PW  (via drill 0.35)
  Top 0.3: C1.1 151.64,4.95 150.42,4.95 C2.1 150.27,4.95 149.12,4.95 R2_PINH.2 148.97,4.95 148.9,4.88 147.98,4.88 R1_PINH.2 147.83,4.88 147.14,5.56 147.14,9.3 | 148.44,9.22 148.44,8.84 SENSOR2.8 | 148.44,9.22 148.82,9.6 149.2,9.6 | 149.2,9.6 149.58,9.6 149.96,9.22 149.96,8.84 SENSOR2.6 | 149.2,9.6 149.2,11.66 SENSOR2.2 | v28.88,53.95 21.72,61.11 21.72,61.42 U2.17 | 147.14,9.3 148.36,9.3 148.44,9.22 | 147.14,9.3 v118.26,9.3
  Bottom 0.3: v118.26,9.3 92.28,35.28 78.56,35.28 75.42,38.42 75.42,38.78 60.25,53.95 v28.88,53.95
INT_RTC
  Top 0.152: 86.79,56.84 86.79,49.84 86.94,49.68 87.86,49.68 88.85,48.69 89,48.69 R1_PINH1.1 | U3.3 87.33,60.2 86.69,59.57 86.69,57.65 86.79,57.55 86.79,56.84 | TP15.TP 23.47,14.33 16.69,21.11 16.69,43.97 U2.8 16.69,44.04 16.69,44.35 22.71,50.37 26.21,50.37 33.91,58.06 56.24,58.06 57.45,56.84 86.79,56.84
IO/BOOT
  Top 0.152: R_BOOT.1 20.27,108.58 21.79,108.58 22.02,108.81 BOOT_BUTTON.4 22.1,108.81 25.53,108.81 BOOT_BUTTON.3 25.6,108.81 25.83,108.58 26.67,108.58 | 26.67,108.58 27.43,108.58 C6.1 | 26.67,108.58 26.67,73.46 24.31,71.09 24.31,61.49 U2.15
IO/CHANGE  (via drill 0.35)
  Top 0.152: C10.1 67.67,108.58 65.99,108.58 65.76,108.81 CHANGE_BUTTON.3 65.68,108.81 62.26,108.81 CHANGE_BUTTON.4 62.18,108.81 61.95,108.58 60.35,108.58 R_CHANGE.1 60.27,108.51 59.66,107.9 v59.36,107.9 | v23.7,67.13 19.43,67.13 14.1,61.8 U2.23
  Bottom 0.152: v23.7,67.13 25.98,67.13 59.36,100.51 v59.36,107.9
MISO  (via drill 0.35)
  Top 0.152: v51.74,37.41 51.74,36.5 R8.1 | v50.83,38.94 51.82,39.93 D12.2 | v36.96,53.26 38.18,53.26 38.56,53.65 38.56,54.18 37.8,54.94 37.8,55.17 U1.2 | v4.5,94.41 5.18,93.73 5.79,93.73 J4.P7 | v9.68,62.79 9.68,62.48 9.07,61.87 9.07,61.49 U2.27 | 29.72,72.08 32.54,72.08 TP6.TP | v28.27,62.1 28.27,70.64 29.72,72.08 | 29.72,72.08 v29.57,72.08
  Bottom 0.152: v51.74,37.41 51.74,38.02 v50.83,38.94 50.83,39.55 37.11,53.26 v36.96,53.26 28.65,53.26 28.27,53.65 v28.27,62.1 | v4.5,94.41 4.5,91.14 9.68,85.95 9.68,72.08 11.68,72.08 | 11.68,72.08 11.68,64.79 v9.68,62.79 | 11.68,72.08 v29.57,72.08
MOSI  (via drill 0.35)
  Top 0.152: v74.83,19.13 74.83,18.97 78.94,14.86 83.97,14.86 84.12,15.01 84.12,15.47 J1.14 | 55.7,36.5 55.17,36.5 R7.1 | 55.7,36.5 v56.08,36.5 | 53.23,51.47 54.94,49.76 54.94,40.01 D11.2 55.02,39.93 55.7,39.24 55.7,36.5 | 53.23,51.47 49.07,55.63 48.46,55.63 47.47,54.63 45.26,54.63 44.88,54.25 44.88,53.65 45.57,52.96 45.57,52.73 U1.5 45.57,52.58 v40.77,47.78 | v18.82,47.78 15.39,44.35 15.39,44.04 U2.7 | J4.P3 5.79,89.23 4.5,87.94 4.5,86.88 v7.88,83.5 | 53.23,51.47 v56.77,55.02 | v70.71,58.98 75.43,63.69 75.55,63.69 85.91,74.05 TP7.TP
  Bottom 0.152: v74.83,19.13 73.46,19.13 v56.08,36.5 | v40.77,47.78 v18.82,47.78 16.96,45.91 10.22,45.91 9.48,46.66 v9.48,47.24 9.5,47.25 9.5,54.38 11.75,56.62 11.75,59.75 7.88,63.62 v7.88,83.5 | v70.71,58.98 60.73,58.98 v56.77,55.02
N$2
  Top 0.152: R2_USB.1 146.69,51.66 149.73,51.66 150.72,52.65 150.72,55.02 152.78,57.07 161.93,57.07 162.92,56.08 163.6,56.08 J2.B5
N$3
  Top 0.152: R2-USB1.2 154.53,55.09 160.93,55.09 162.99,53.03 163.6,53.03 J2.A5
N$4
  Top 0.152: R1_BAT.2 116.97,52.2 119.41,52.2 119.63,52.43 125.2,52.43 126.34,51.28 126.64,51.28 MCP73831.1
N$5
  Top 0.152: CHG_LED.C 120.02,51.74 117.73,51.74 117.42,51.44 116.36,51.44 115.67,52.12 R1_BAT.1
N$6
  Top 0.152: IC1.5 50.6,101.96 51.44,101.96 52.58,100.81 C_DELAY.1
N$7
  Top 0.152: C1_BAT1.1 120.62,38.48 120.62,39.93 121.16,40.46 121.16,40.62 D2.1 121.31,40.62 121.46,40.77 122.99,40.77 | 122.99,40.77 123.67,40.77 IC4.3 | 122.99,40.77 122.99,42.14 123.52,42.67 123.67,42.67 IC4.1 123.75,42.75 124.28,43.28 126.72,43.28 131.98,48.54 132.21,48.54 Q1.2
N$8
  Top 0.152: R2_BAT.2 121.08,50.14 122.99,50.14 124.05,51.21 MCP73831.5
N$9
  Top 0.152: 91.1,32.35 90.53,32.92 D3.2 | 91.1,32.35 91.14,32.31 94.64,32.31 95.02,32.69 96.09,32.69 C4.1 | 91.1,32.35 90.37,31.62 90.37,28.96 D4.1
N$10
  Top 0.152: J1.22 80.24,15.54 80.24,20.5 82.45,22.71 EPD_C10.1
N$11  (via drill 0.35)
  Top 0.152: v90.07,13.95 91.14,15.01 91.14,15.93 90.91,16.15 89.46,16.15 89.23,15.93 89.23,15.54 J1.4 | v74.83,20.04 74.14,20.04 73.84,20.34 EPD_C1.1
  Bottom 0.152: v90.07,13.95 80.92,13.95 v74.83,20.04
N$12
  Top 0.152: J1.24 79.17,15.54 79.17,21.87 78.33,22.71 EPD_C12.1
N$13
  Top 0.152: J1.20 81.23,15.54 81.23,17.91 86.18,22.86 EPD_C8.1
N$14
  Top 0.152: J1.19 81.76,15.54 81.76,16.54 88.09,22.86 EPD_C7.1
N$15
  Top 0.152: R_CAPACITOR.1 89.08,63.17 89.08,64.31 89.38,64.62 D7.1
N$16
  Top 0.152: J1.18 82.22,15.54 82.22,16.08 88.39,22.25 89.38,22.25 89.99,22.86 EPD_C6.1
N$22
  Top 0.152: J1.5 88.62,15.47 88.62,15.01 86.94,13.34 79.7,13.34 72.69,20.34 72.47,20.34 EPD_C2.1
PREVGH  (via drill 0.35)
  Top 0.152: J1.21 80.7,15.54 80.7,19.28 84.28,22.86 EPD_C9.1 84.35,22.94 84.96,23.55 v87.17,23.55 | v83.67,34.59 83.67,35.89 D5.1
  Bottom 0.152: v83.67,34.59 83.67,27.05 v87.17,23.55
PREVGL
  Top 0.152: J1.23 79.7,15.54 79.7,22.1 80.39,22.78 EPD_C11.1 80.47,22.86 81.15,23.55 81.15,23.93 82.07,24.84 87.55,24.84 91.59,28.88 93.8,28.88 D4.2
RESE
  Top 0.152: J1.3 89.69,15.47 89.69,15.09 87.63,13.03 79.55,13.03 74.91,17.68 73.46,17.68 R3.2 73.38,17.75 73.38,18.06 72.69,18.75 71.48,18.75 70.64,17.91 Q3.2
RESE'
  Top 0.152: 72.16,13.34 71.4,13.34 70.87,12.8 SJ1.2 | 72.16,13.34 73.53,13.34 R2.2 | 72.16,13.34 72.16,17.68 R3.1
RESET  (via drill 0.35)
  Top 0.152: C5.1 52.35,108.58 50.98,108.58 50.75,108.81 RESET_BUTTON.3 50.67,108.81 47.24,108.81 RESET_BUTTON.4 47.17,108.81 45.64,108.81 45.41,108.58 R_RESET.1 45.34,108.51 44.65,107.82 44.65,106.15 47.7,103.1 47.7,102.03 IC1.1 47.62,102.03 47.47,101.88 v46.71,101.88 | U2.3 10.28,46.33 v10.48,46.52
  Bottom 0.152: v46.71,101.88 46.71,88.32 29.87,71.48 26.92,71.48 21.99,66.55 21.99,66.42 9.98,54.41 9.98,47.78 10.21,47.55 10.21,46.79 v10.48,46.52
RTC_RST
  Top 0.152: U2.16 23.01,61.42 23.01,61.19 25.83,58.37 62.61,58.37 62.65,58.41 63.15,58.41 63.19,58.37 82.68,58.37 83.82,57.23 84.43,57.23 86.03,58.83 86.03,60.2 U3.4
RX
  Top 0.152: U2.24 12.88,61.49 12.88,61.87 22.94,71.93 23.39,71.93 TP2.TP
SCK  (via drill 0.35)
  Top 0.152: 46.52,52.77 47.09,52.2 47.09,43.2 | 46.52,52.77 45.64,53.65 45.64,53.87 U1.6 | 47.09,43.2 47.09,39.93 D10.2 | v52.73,58.98 72.39,78.64 85.8,78.64 TP8.TP | 46.52,52.77 v48.77,55.02 | v84.66,16.46 84.66,15.54 J1.13 | v57.61,35.89 47.4,35.89 46.94,36.35 R6.1 46.86,36.42 42.9,40.39 42.9,42.29 43.8,43.2 47.09,43.2 | v16.08,41.68 14.1,43.66 14.1,43.97 U2.6 | v4.27,90.45 5.26,91.44 5.79,91.44 J4.P5
  Bottom 0.152: v52.73,58.98 v48.77,55.02 | v84.66,16.46 83.36,16.46 72.31,27.51 65.99,27.51 v57.61,35.89 56.39,37.11 55.78,37.11 55.47,36.8 47.78,36.8 42.9,41.68 v16.08,41.68 13.49,41.68 8.87,46.29 8.87,61.6 6.87,63.6 6.87,87.39 4.27,89.99 v4.27,90.45
SCL  (via drill 0.35)
  Top 0.152: v149.05,7.7 149.05,6.33 R2_PINH.1 | v149.96,10.59 150.72,11.35 150.72,11.66 SENSOR2.4 | 136.36,53.53 165.43,24.46 165.43,20.65 J3.4 165.35,20.65 164.9,20.19 v164.21,20.19 | 136.36,53.53 135.79,54.1 135.41,54.1 U4.7 | U2.20 17.91,62.04 20.56,64.69 v21.18,64.69 | U3.16 89.92,50.98 v90.75,50.98 91.36,50.37 v94.18,50.37 | v136.32,53.49 136.36,53.53
  Bottom 0.152: v149.05,7.7 149.05,9.68 v149.96,10.59 149.96,10.52 150.5,9.98 154,9.98 v164.21,20.19 | v21.18,64.69 74.6,64.69 75.82,65.91 76.43,65.91 83.52,58.83 83.52,54.18 86.72,50.98 v90.75,50.98 | v136.32,53.49 97.31,53.49 v94.18,50.37
SDA  (via drill 0.35)
  Top 0.152: 152.36,11.16 151.03,12.5 150.5,12.5 150.04,12.04 150.04,11.73 SENSOR2.3 | 152.36,11.16 152.4,11.12 152.4,5.79 152.25,5.64 148.44,5.64 147.98,6.1 R1_PINH.1 | v160.78,19.58 165.43,19.58 J3.3 | v152.4,11.2 152.36,11.16 | v134.57,55.17 135.03,54.71 135.33,54.71 U4.8 | v88.62,53.11 88.62,50.98 U3.15 | U2.19 19.2,61.49 19.2,61.78 19.89,62.47 20.05,62.47 20.41,62.82 20.41,63 v23.62,66.22
  Bottom 0.152: v152.4,11.2 v160.78,19.58 160.71,19.58 160.71,40.08 155.17,45.62 151.84,45.62 151.62,45.84 151.62,49.17 145.62,55.17 v134.57,55.17 90.68,55.17 89.19,53.68 | v88.62,53.11 89.19,53.68 | v23.62,66.22 26.06,66.22 26.35,66.51 76.37,66.51 89.19,53.68
SRC
  Top 0.152: C4.2 96.09,33.98 83.13,33.98 82.53,33.38 L1.1 82.45,33.38 80.01,35.81 D5.2 80.09,35.97 73.76,29.64 73.76,27.81 69.95,24 69.95,20.04 Q3.3
SS_SD  (via drill 0.35)
  Top 0.152: 10.25,97.65 10.29,97.61 13.41,97.61 14.1,98.3 D8.2 | 10.25,97.65 7.39,100.51 7.09,100.51 R10.1 | 10.25,97.65 10.21,97.61 10.21,92.13 6.25,88.16 J4.P2 6.25,88.09 8.92,85.42 v8.88,85.38 | U2.4 11.55,52.71 11.51,52.76 11.51,56.55 11.5,56.62 11.25,56.88 v11.12,56.88
  Bottom 0.152: v11.12,56.88 11.12,59.88 7.25,63.75 7.25,83.75 v8.88,85.38
TX
  Top 0.152: U2.25 11.58,61.49 11.58,64.54 18.97,71.93 TP1.TP
USB_D+  (via drill 0.35)
  Top 0.152: v71.48,43.74 92.73,43.74 105.23,56.24 135.33,56.24 137.01,54.56 149.43,54.56 D1.1 | v35.13,54.63 34.9,54.63 24.31,44.04 U2.14
  Bottom 0.152: v71.48,43.74 71.09,43.74 60.43,54.41 35.36,54.41 v35.13,54.63
USB_D-  (via drill 0.35)
  Top 0.152: v147.6,52.27 147.9,52.58 149.43,52.58 D1.3 | v100.36,52.27 92.43,44.35 67.51,44.35 57.38,54.48 57.38,55.32 55.24,57.45 37.03,57.45 24.61,45.03 23.7,45.03 23.01,44.35 23.01,44.04 U2.13
  Bottom 0.152: v100.36,52.27 v147.6,52.27
VBAT
  Top 0.152: U4.3 133.43,53.72 133.43,54.1 U4.2 133.35,54.18 130.23,54.18 129.69,54.71 C2_BAT.1 129.62,54.71 128.93,54.03 128.93,53.11 | 128.93,53.11 128.93,52.96 131.22,50.67 Q1.3 131.29,50.6 131.83,50.6 134.34,48.08 134.34,40.39 126.03,32.08 126.03,13.56 TP3.TP | 128.93,53.11 126.72,53.11 MCP73831.3
VBUS
  Top 0.3: D1.5 151.94,53.57 153.16,53.57 153.77,52.96 153.77,52.35 152.25,50.83 151.94,50.83 C5_USB.1 151.79,50.75 151.71,50.67 151.71,49.45 C4_USB.1 151.56,49.38 148.59,46.41 147.75,46.41 PFMF.050.1.2 147.6,46.41 144.55,46.41 135.1,55.85 126.87,55.85 124.21,53.19 MCP73831.4 124.05,53.11 115.37,53.11 114.99,52.73 114.99,51.51 115.52,50.98 120.7,50.98 121.46,51.74 CHG_LED.A 121.61,51.82 123.29,51.82 123.37,51.89 124.74,51.89 125.35,51.28 125.35,48.62 | 120.02,42.22 120.7,42.22 121.16,42.67 D2.2 121.31,42.82 121.31,44.2 124.44,47.32 C1_BAT.1 124.59,47.47 125.35,48.23 125.35,48.62 | 120.02,42.22 119.25,42.22 R1_PWRUSB.2 | 125.35,48.62 130.3,48.62 Q1.1 | 120.02,42.22 120.02,40.39 119.63,40.01 119.63,37.64 120.78,36.5 120.78,13.41 TP14.TP
VRTC
  Top 0.152: C10_SUPERCAP.2 95.63,50.98 93.19,50.98 C8.1 93.12,51.05 91.59,51.05 88.92,53.72 87.94,53.72 | 87.94,53.72 87.94,51.51 87.4,50.98 U3.14 | 87.94,53.72 87.94,61.34 87.78,61.49 87.78,63.09 R_CAPACITOR.2
VUSB  (via drill 0.35)
  Top 0.3: PFMF.050.1.1 152.84,47 159,47 v162,50 162,51 162.71,51.71 J2.A4 J2.B9 165.01,52.01 166,53 166,55 164.49,56.51 J2.B4 J2.A9